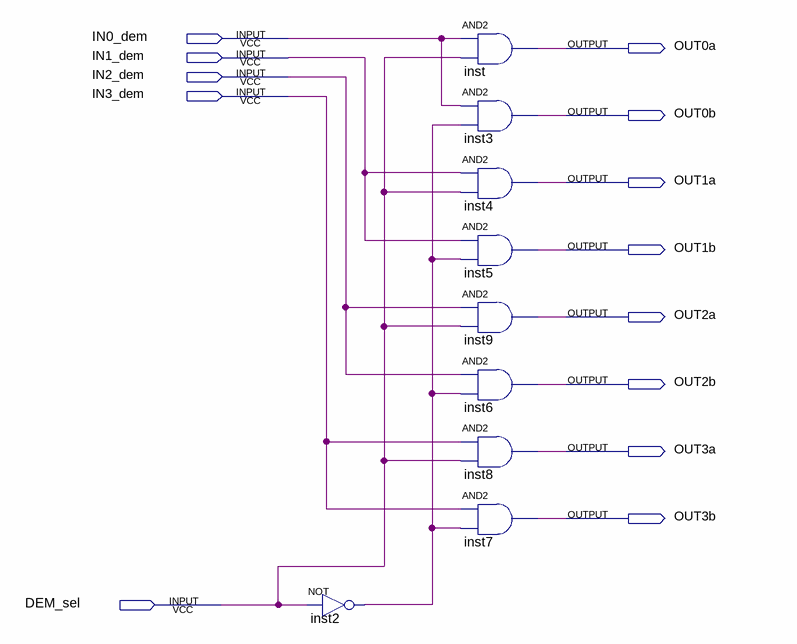
[diagram p0: schematic sheet]
// Quartus schematic Demux.bdf as structural Verilog: 9 symbols, 13 pins
module Demux (
  input  IN0_dem,
  input  IN1_dem,
  input  IN2_dem,
  input  IN3_dem,
  input  DEM_sel,
  output OUT0a,
  output OUT0b,
  output OUT1a,
  output OUT1b,
  output OUT2a,
  output OUT2b,
  output OUT3a,
  output OUT3b
);

  wire inst2_out;

  not inst2 (inst2_out, DEM_sel);
  and inst (OUT0a, IN0_dem, DEM_sel);
  and inst3 (OUT0b, IN0_dem, inst2_out);
  and inst4 (OUT1a, IN1_dem, DEM_sel);
  and inst5 (OUT1b, IN1_dem, inst2_out);
  and inst9 (OUT2a, IN2_dem, DEM_sel);
  and inst6 (OUT2b, IN2_dem, inst2_out);
  and inst8 (OUT3a, IN3_dem, DEM_sel);
  and inst7 (OUT3b, IN3_dem, inst2_out);
endmodule
